# Altium schematic sheet [3]-MCU_MAIN.SchDoc
size A4
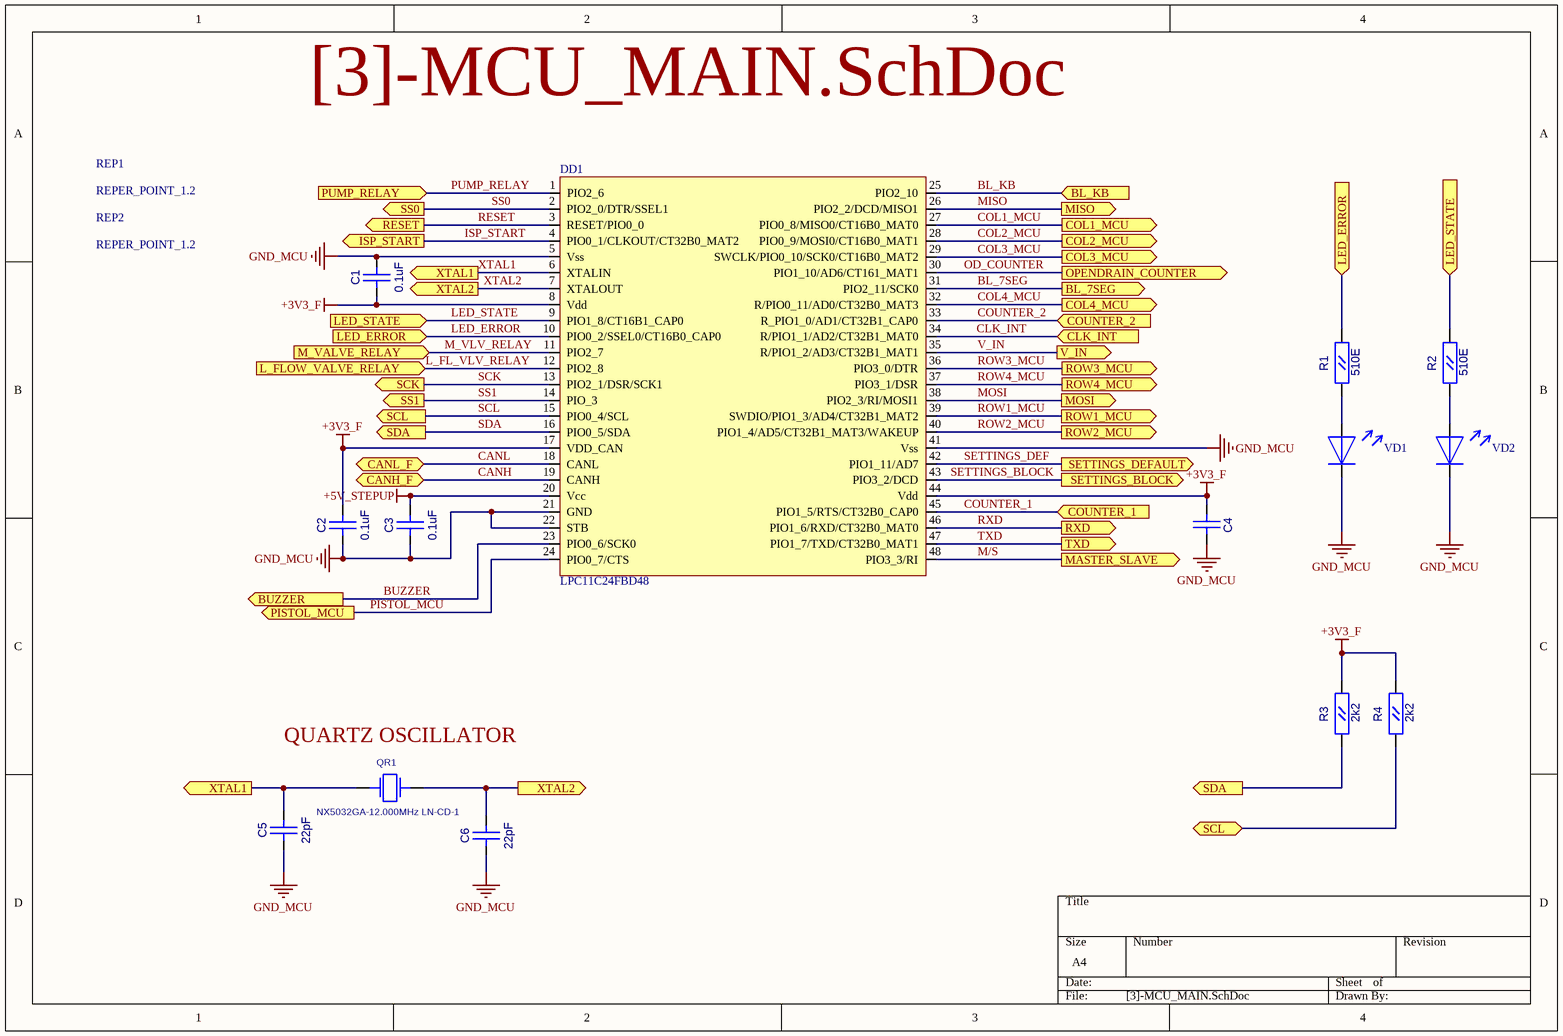
[diagram p0: [3]-MCU_MAIN.SchDoc]

## Parts
C1  0.1uF  [CC0603]
C2  0.1uF  [CC0603]
C3  0.1uF  [CC0603]
C4  (no value)  [CC0603]
C5  22pF  [CC0603]
C6  22pF  [CC0603]
DD1  LPC11C24FBD48  [LQFP48]
QR1  NX5032GA-12.000MHz LN-CD-1  [AC5032_2]
R1  510E  [RC0603]
R2  510E  [RC0603]
R3  2k2  [RC0603]
R4  2k2  [RC0603]
REP1  REPER_POINT_1.2  [REPER1.2]
REP2  REPER_POINT_1.2  [REPER1.2]
VD1  LED_0805  [LED0805]  (value not drawn)
VD2  LED_0805  [LED0805]  (value not drawn)

## Ports
BL_7SEG (out), BL_KB (in), BUZZER (out), CANH_F (bidir), CANL_F (bidir), CLK_INT (in), COL1_MCU (out), COL2_MCU (out), COL3_MCU (out), COL4_MCU (out), COUNTER_1 (in), COUNTER_2 (in), ISP_START (out), L_FLOW_VALVE_RELAY (in), LED_ERROR (in), LED_STATE (in), M_VALVE_RELAY (in), MASTER_SLAVE (out), MISO (out), MOSI (out), OPENDRAIN_COUNTER (out), PISTOL_MCU (out), PUMP_RELAY (in), RESET (out), ROW1_MCU (out), ROW2_MCU (out), ROW3_MCU (out), ROW4_MCU (out), RXD (out), SCK (out), SCL (bidir), SCL (out), SDA (out), SETTINGS_BLOCK (out), SETTINGS_DEFAULT (out), SS0 (out), SS1 (out), TXD (out), V_IN (out), XTAL1 (out), XTAL2 (out)

## Nets
+3V3_F: C1.1(A) C2.2(B) C4.1(A) DD1.8(Vdd) DD1.17(VDD_CAN) DD1.44(Vdd) R3.2(B) R4.2(B)
+5V_STEPUP: C3.2(B) DD1.20(Vcc)
GND_MCU: C1.2(B) C2.1(A) C3.1(A) C4.2(B) C5.1(A) C6.1(A) DD1.5(Vss) DD1.21(GND) DD1.22(STB) DD1.41(Vss) VD1.2 VD2.2
BL_7SEG: DD1.31(PIO2_11/SCK0) ; port BL_7SEG
BL_KB: DD1.25(PIO2_10) ; port BL_KB
BUZZER: DD1.23(PIO0_6/SCK0) ; port BUZZER
CANH: DD1.19(CANH) ; port CANH_F
CANL: DD1.18(CANL) ; port CANL_F
CLK_INT: DD1.34(R/PIO1_1/AD2/CT32B1_MAT0) ; port CLK_INT
COL1_MCU: DD1.27(PIO0_8/MISO0/CT16B0_MAT0) ; port COL1_MCU
COL2_MCU: DD1.28(PIO0_9/MOSI0/CT16B0_MAT1) ; port COL2_MCU
COL3_MCU: DD1.29(SWCLK/PIO0_10/SCK0/CT16B0_MAT2) ; port COL3_MCU
COL4_MCU: DD1.32(R/PIO0_11/AD0/CT32B0_MAT3) ; port COL4_MCU
COUNTER_1: DD1.45(PIO1_5/RTS/CT32B0_CAP0) ; port COUNTER_1
COUNTER_2: DD1.33(R_PIO1_0/AD1/CT32B1_CAP0) ; port COUNTER_2
ISP_START: DD1.4(PIO0_1/CLKOUT/CT32B0_MAT2) ; port ISP_START
L_FL_VLV_RELAY: DD1.12(PIO2_8) ; port L_FLOW_VALVE_RELAY
LED_ERROR: DD1.10(PIO0_2/SSEL0/CT16B0_CAP0) R1.2(B) ; port LED_ERROR
LED_STATE: DD1.9(PIO1_8/CT16B1_CAP0) R2.2(B) ; port LED_STATE
M/S: DD1.48(PIO3_3/RI) ; port MASTER_SLAVE
M_VLV_RELAY: DD1.11(PIO2_7) ; port M_VALVE_RELAY
MISO: DD1.26(PIO2_2/DCD/MISO1) ; port MISO
MOSI: DD1.38(PIO2_3/RI/MOSI1) ; port MOSI
OD_COUNTER: DD1.30(PIO1_10/AD6/CT161_MAT1) ; port OPENDRAIN_COUNTER
PISTOL_MCU: DD1.24(PIO0_7/CTS) ; port PISTOL_MCU
PUMP_RELAY: DD1.1(PIO2_6) ; port PUMP_RELAY
RESET: DD1.3(RESET/PIO0_0) ; port RESET
ROW1_MCU: DD1.39(SWDIO/PIO1_3/AD4/CT32B1_MAT2) ; port ROW1_MCU
ROW2_MCU: DD1.40(PIO1_4/AD5/CT32B1_MAT3/WAKEUP) ; port ROW2_MCU
ROW3_MCU: DD1.36(PIO3_0/DTR) ; port ROW3_MCU
ROW4_MCU: DD1.37(PIO3_1/DSR) ; port ROW4_MCU
RXD: DD1.46(PIO1_6/RXD/CT32B0_MAT0) ; port RXD
SCK: DD1.13(PIO2_1/DSR/SCK1) ; port SCK
SCL: DD1.15(PIO0_4/SCL) R4.1(A) ; port SCL
SDA: DD1.16(PIO0_5/SDA) R3.1(A) ; port SDA
SETTINGS_BLOCK: DD1.43(PIO3_2/DCD) ; port SETTINGS_BLOCK
SETTINGS_DEF: DD1.42(PIO1_11/AD7) ; port SETTINGS_DEFAULT
SS0: DD1.2(PIO2_0/DTR/SSEL1) ; port SS0
SS1: DD1.14(PIO_3) ; port SS1
TXD: DD1.47(PIO1_7/TXD/CT32B0_MAT1) ; port TXD
V_IN: DD1.35(R/PIO1_2/AD3/CT32B1_MAT1) ; port V_IN
XTAL1: C5.2(B) DD1.6(XTALIN) QR1.1 ; port XTAL1
XTAL2: C6.2(B) DD1.7(XTALOUT) QR1.2 ; port XTAL2
NetR1_1: R1.1(A) VD1.1
NetR2_1: R2.1(A) VD2.1

Not connected (* = marked no-connect by the designer): REP1 1; REP2 1

## Notes on the sheet
- (near QR1) QUARTZ OSCILLATOR

## Library data of the parts
C1-C6 = CC0603
  C1-C3: Value: 0.1uF
  C5 C6: Value: 22pF
QR1 = AC5032_2: AC5032/2; Value: NX5032GA-12.000MHz LN-CD-1
R1-R4 = RC0603
  R1 R2: Value: 510E
  R3 R4: Value: 2k2
REP1 REP2 = REPER1.2: Value: REPER_POINT_1.2
DD1 = LPC11C24FBD48: Value: LPC11C24FBD48
VD1 VD2 = LED_0805: Value: LED_0805